# EAGLE schematic Power Switching Circuit rev2 (EAGLE 9.6.2)
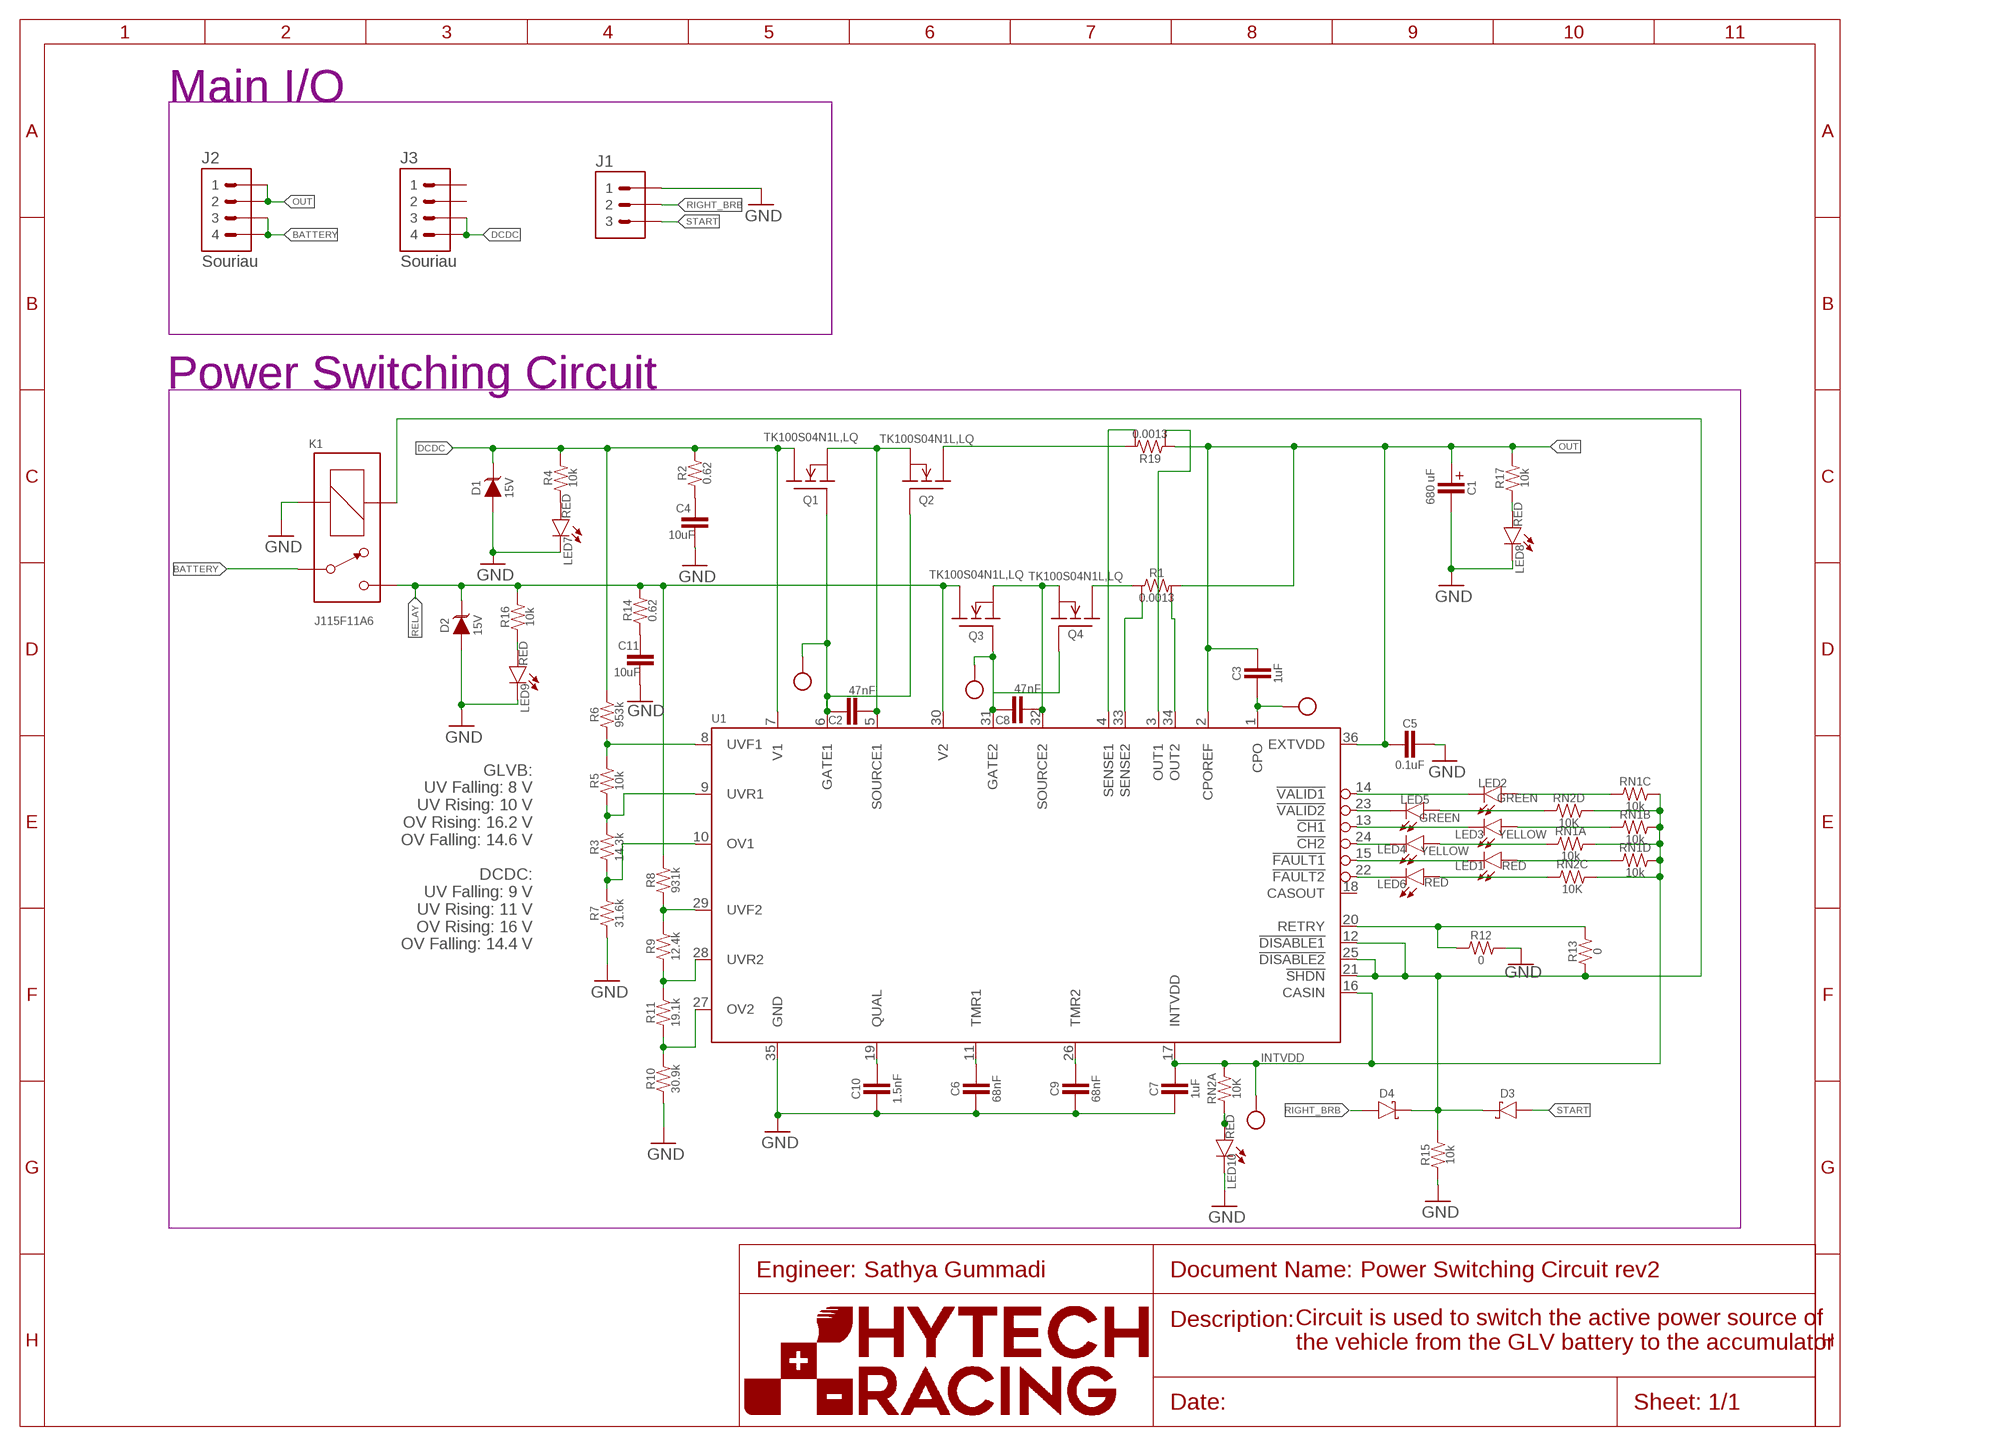
[diagram p0: schematic, sheet 1]
U$2 (FRAME_A): FRAME_DESCRIPTION: Default; ORIENTATION: LANDSCAPE; SIZE: A

## Parts
C1  CAPACITOR_POLARIZED  [EEE-FK1H681AM]
C2  47nF  CAP0603-CAP  [0603-CAP@1]
C3  1uF  CAP0805  [0805]
C4  10uF  CAPACITOR_VALUE1206  [1206-CAP]
C5  0.1uF  CAP0603-CAP  [0603-CAP@1]
C6  68nF  CAP0603-CAP  [0603-CAP@1]
C7  1uF  CAP0805  [0805]
C8  47nF  CAP0603-CAP  [0603-CAP@1]
C9  68nF  CAP0603-CAP  [0603-CAP@1]
C10  1.5nF  CAP0603-CAP  [0603-CAP@1]
C11  10uF  CAPACITOR_VALUE1206  [1206-CAP]
D1  TVS_15V  [SOT-23]
D2  TVS_15V  [SOT-23]
D3  SCHOTTKY  [CLP1608-2L]
D4  SCHOTTKY  [CLP1608-2L]
J1  CONNECTOR-3_  [SOURIAU_04-35]
J2  CONNECTOR-4_SOURIAU_  [SOURIAU_12-04]
J3  CONNECTOR-4_SOURIAU_  [SOURIAU_12-04]
K1  J115F11A6  [J115F11A*6*]
LED1  RED  LED-0603  [LED-603]
LED2  GREEN  LED-0603  [LED-603]
LED3  YELLOW  LED-0603  [LED-603]
LED4  YELLOW  LED-0603  [LED-603]
LED5  GREEN  LED-0603  [LED-603]
LED6  RED  LED-0603  [LED-603]
LED7  RED  LED-0603  [LED-603]
LED8  RED  LED-0603  [LED-603]
LED9  RED  LED-0603  [LED-603]
LED10  RED  LED-0603  [LED-603]
Q1  TK100S04N1L  [TO-252-3]
Q2  TK100S04N1L  [TO-252-3]
Q3  TK100S04N1L  [TO-252-3]
Q4  TK100S04N1L  [TO-252-3]
R1  RESISTOR_SENSE  [WSL2726]
R2  0.62  RESISTOR0805  [0805]
R3  14.3k  RESISTOR0603  [0603-RES]
R4  10k  RESISTOR0603  [0603-RES]
R5  10k  RESISTOR0603  [0603-RES]
R6  953k  RESISTOR0603  [0603-RES]
R7  31.6k  RESISTOR0603  [0603-RES]
R8  931k  RESISTOR0603  [0603-RES]
R9  12.4k  RESISTOR0603  [0603-RES]
R10  30.9k  RESISTOR0603  [0603-RES]
R11  19.1k  RESISTOR0603  [0603-RES]
R12  0  RESISTOR0603  [0603-RES]
R13  0  RESISTOR0603  [0603-RES]
R14  0.62  RESISTOR0805  [0805]
R15  10k  RESISTOR0603  [0603-RES]
R16  10k  RESISTOR0603  [0603-RES]
R17  10k  RESISTOR0603  [0603-RES]
R19  RESISTOR_SENSE  [WSL2726]
RN1  RESISTOR_NETWORK_4_10K  [YC/TC164]
RN2  RESISTOR_NETWORK_4_10K  [1206-RES]
U1  LTC4421  [SSOP-36]
U$7  TEST_POINTMICRO_MINIATURE  [MICRO_MINIATURE]
U$8  TEST_POINTMICRO_MINIATURE  [MICRO_MINIATURE]
U$9  TEST_POINTMICRO_MINIATURE  [MICRO_MINIATURE]
U$10  TEST_POINTMICRO_MINIATURE  [MICRO_MINIATURE]

## Nets
!CH1: LED3.C U1.13(!CH1)
!CH2: LED4.C U1.24(!CH2)
!FAULT1: LED1.C U1.15(!FAULT1)
!FAULT2: LED6.C U1.22(!FAULT2)
!SHDN!: D3.2(C) D4.2(C) K1.COIL1(COIL+) R13.1 R15.2 U1.12(!DISABLE1) U1.21(!SHDN) U1.25(!DISABLE2)
!VALID1: LED2.C U1.14(!VALID1)
!VALID2: LED5.C U1.23(!VALID2)
BATTERY: J2.3 J2.4 K1.CONTACT1(P)
CPO: C3.2 U1.1(CPO) U$9.P$1
DCDC: D1.3(C) J3.3 J3.4 Q1.2(D) R2.2 R4.2 R6.2 U1.7(V1)
GATE1: C2.2 Q1.1(G) Q2.1(G) U1.6(GATE1) U$10.P$1
GATE2: C8.2 Q3.1(G) Q4.1(G) U1.31(GATE2) U$7.P$1
GND: C1.P$2(MINUS) C4.2 C5.1 C6.2 C7.2 C9.2 C10.2 C11.2 D1.1(A) D2.1(A) J1.A K1.COIL2(COIL-) LED7.C LED8.C LED9.C LED10.C R7.1 R10.1 R12.2 R15.1 U1.35(GND)
INTVDD: C7.1 RN1.5 RN1.6 RN1.7 RN1.8 RN2.5 RN2.6 RN2.8 U1.16(CASIN) U1.17(INTVDD) U$8.P$1
N$1: C10.1 U1.19(QUAL)
N$2: C6.1 U1.11(TMR1)
N$3: C9.1 U1.26(TMR2)
N$4: C11.1 R14.1
N$5: Q4.2(D) R1.1
N$6: LED9.A R16.1
N$7: LED7.A R4.1
N$8: Q2.2(D) R19.2
N$9: LED10.A RN2.1
N$10: LED8.A R17.1
N$11: LED6.A RN2.3
N$13: LED1.A RN1.4
N$15: LED4.A RN1.1
N$17: LED3.A RN1.2
N$19: LED5.A RN2.4
N$21: LED2.A RN1.3
N$22: C4.1 R2.1
OUT: C1.P$1(PLUS) C3.1 C5.2 J2.1 J2.2 R1.2 R17.2 R19.1 U1.2(CPOREF) U1.36(EXTVDD)
OUT1: R19.3 U1.3(OUT1)
OUT2: R1.4 U1.34(OUT2)
OV1: R3.1 R7.2 U1.10(OV1)
OV2: R10.2 R11.1 U1.27(OV2)
RELAY: D2.3(C) K1.CONTACT2(S) Q3.2(D) R8.2 R14.2 R16.2 U1.30(V2)
RETRY: R12.1 R13.2 U1.20(RETRY)
RIGHT_BRB: D4.1(A) J1.B
SENSE: R19.4 U1.4(SENSE1)
SENSE2: R1.3 U1.33(SENSE2)
SOURCE1: C2.1 Q1.3(S) Q2.3(S) U1.5(SOURCE1)
SOURCE2: C8.1 Q3.3(S) Q4.3(S) U1.32(SOURCE2)
START: D3.1(A) J1.C
UVF1: R5.2 R6.1 U1.8(UVF1)
UVF2: R8.1 R9.2 U1.29(UVF2)
UVR1: R3.2 R5.1 U1.9(UVR1)
UVR2: R9.1 R11.2 U1.28(UVR2)
Unconnected: J3.1 J3.2 RN2.2 RN2.7 U1.18(CASOUT)

## Notes on the sheet
- Main I/O
- Power Switching Circuit
- 680 uF
- GLVB:
  UV Falling: 8 V
  UV Rising: 10 V
  OV Rising: 16.2 V
  OV Falling: 14.6 V
  
  DCDC:
  UV Falling: 9 V
  UV Rising: 11 V
  OV Rising: 16 V
  OV Falling: 14.4 V
- Sathya Gummadi
- Circuit is used to switch the active power source of 
  the vehicle from the GLV battery to the accumulator

## Library data of the parts
C1 = HyTechDevices:CAPACITOR_POLARIZED; RESISTANCE: 680 uF
C2 C3 C5-C10 = HyTechDevices:CAP: Capacitor Standard 0603 ceramic capacitor, and 0.1" leaded capacitor.
C4 C11 = HyTechDevices:CAPACITOR_VALUE: Capacitor for prototyping circuits
D1 D2 = HyTechDevices:TVS_*: TVS Diode GSOT Datasheet <https://www.mouser.com/datasheet/2/427/gsot03-1767593.pdf>; DKPN: GSOT15-E3-08CT-ND; MANUFACTURER: Vishay General Semiconductor - Diodes Division; MOPN: 78-GSOT15-E3-08; MPN: GSOT15-E3-08; VOLTAGE: 15V
D3 D4 = HyTechDevices:SCHOTTKY: Schottky Rectifier Diode Datasheet <https://www.vishay.com/docs/85892/vsky20401608.pdf>; DKPN: 112-VSKY20401608-G4-08CT-ND; MANUFACTURER: Vishay General Semiconductor - Diodes Division; MOPN: 78-VSKY20401608G408; MPN: VSKY20401608-G4-08
J1 = HyTechDevices:CONNECTOR-3_?
J2 J3 = HyTechDevices:CONNECTOR-4_?_*; MANUFACTURER: Souriau; MODEL: Souriau; MPN: 8STA21204PN
K1 = HyTechDevices:J115F11A*6*
LED1-LED10 = HyTechDevices:LED: Light Emitting Diode (LED) Source: Dangerous Prototypes Eagle Library <https://github.com/DangerousPrototypes/Eagle_Part_Library>
Q1-Q4 = HyTechDevices:TK100S04N1L: Toshiba TK100S04N1L or ON Semiconductor FDD9407-F085; MPN: TK100S04N1L,LQ
R1 R19 = HyTechDevices:RESISTOR_SENSE: Sense Resistor; MPN: WSL2726; RESISTANCE: 0.0013
R2-R17 = HyTechDevices:RESISTOR: Resistor Basic schematic elements and footprints for 0603, 1206, and PTH resistors.
RN1 = HyTechDevices - Copy:RESISTOR_NETWORK_4_*: Resistor Network w/ 4 Indepedent Resistors Yageo TC Series <https://www.yageo.com/upload/media/product/productsearch/datasheet/rchip/PYu-YC_TC_group_51_RoHS_L_9.pdf>; RESISTANCE: 10k
RN2 = HyTechDevices:RESISTOR_NETWORK_4_*: Resistor Network, 4 Elements YC/TC Series <https://www.mouser.com/datasheet/2/447/yageo_yago_s_a0009164376_1-1991537.pdf> CAT/CAY 16 Series <https://www.mouser.com/datasheet/2/54/CATCAY-777361.pdf>; DKPN: YAG3410CT-ND; MANUFACTURER: Yageo; MOPN: 603-TC164-FR-0710KL; MPN: TC164-FR-0710KL; POWER: 1/16W; RESISTANCE: 10K; TOLERANCE: 1%; VOLTAGE: 50V
U1 = HyTechDevices:LTC4421
U$7-U$10 = HyTechDevices:TEST_POINT: Keystone Electronics Test Point 5005